# EAGLE design Cyllene (EAGLE 9.6.2)
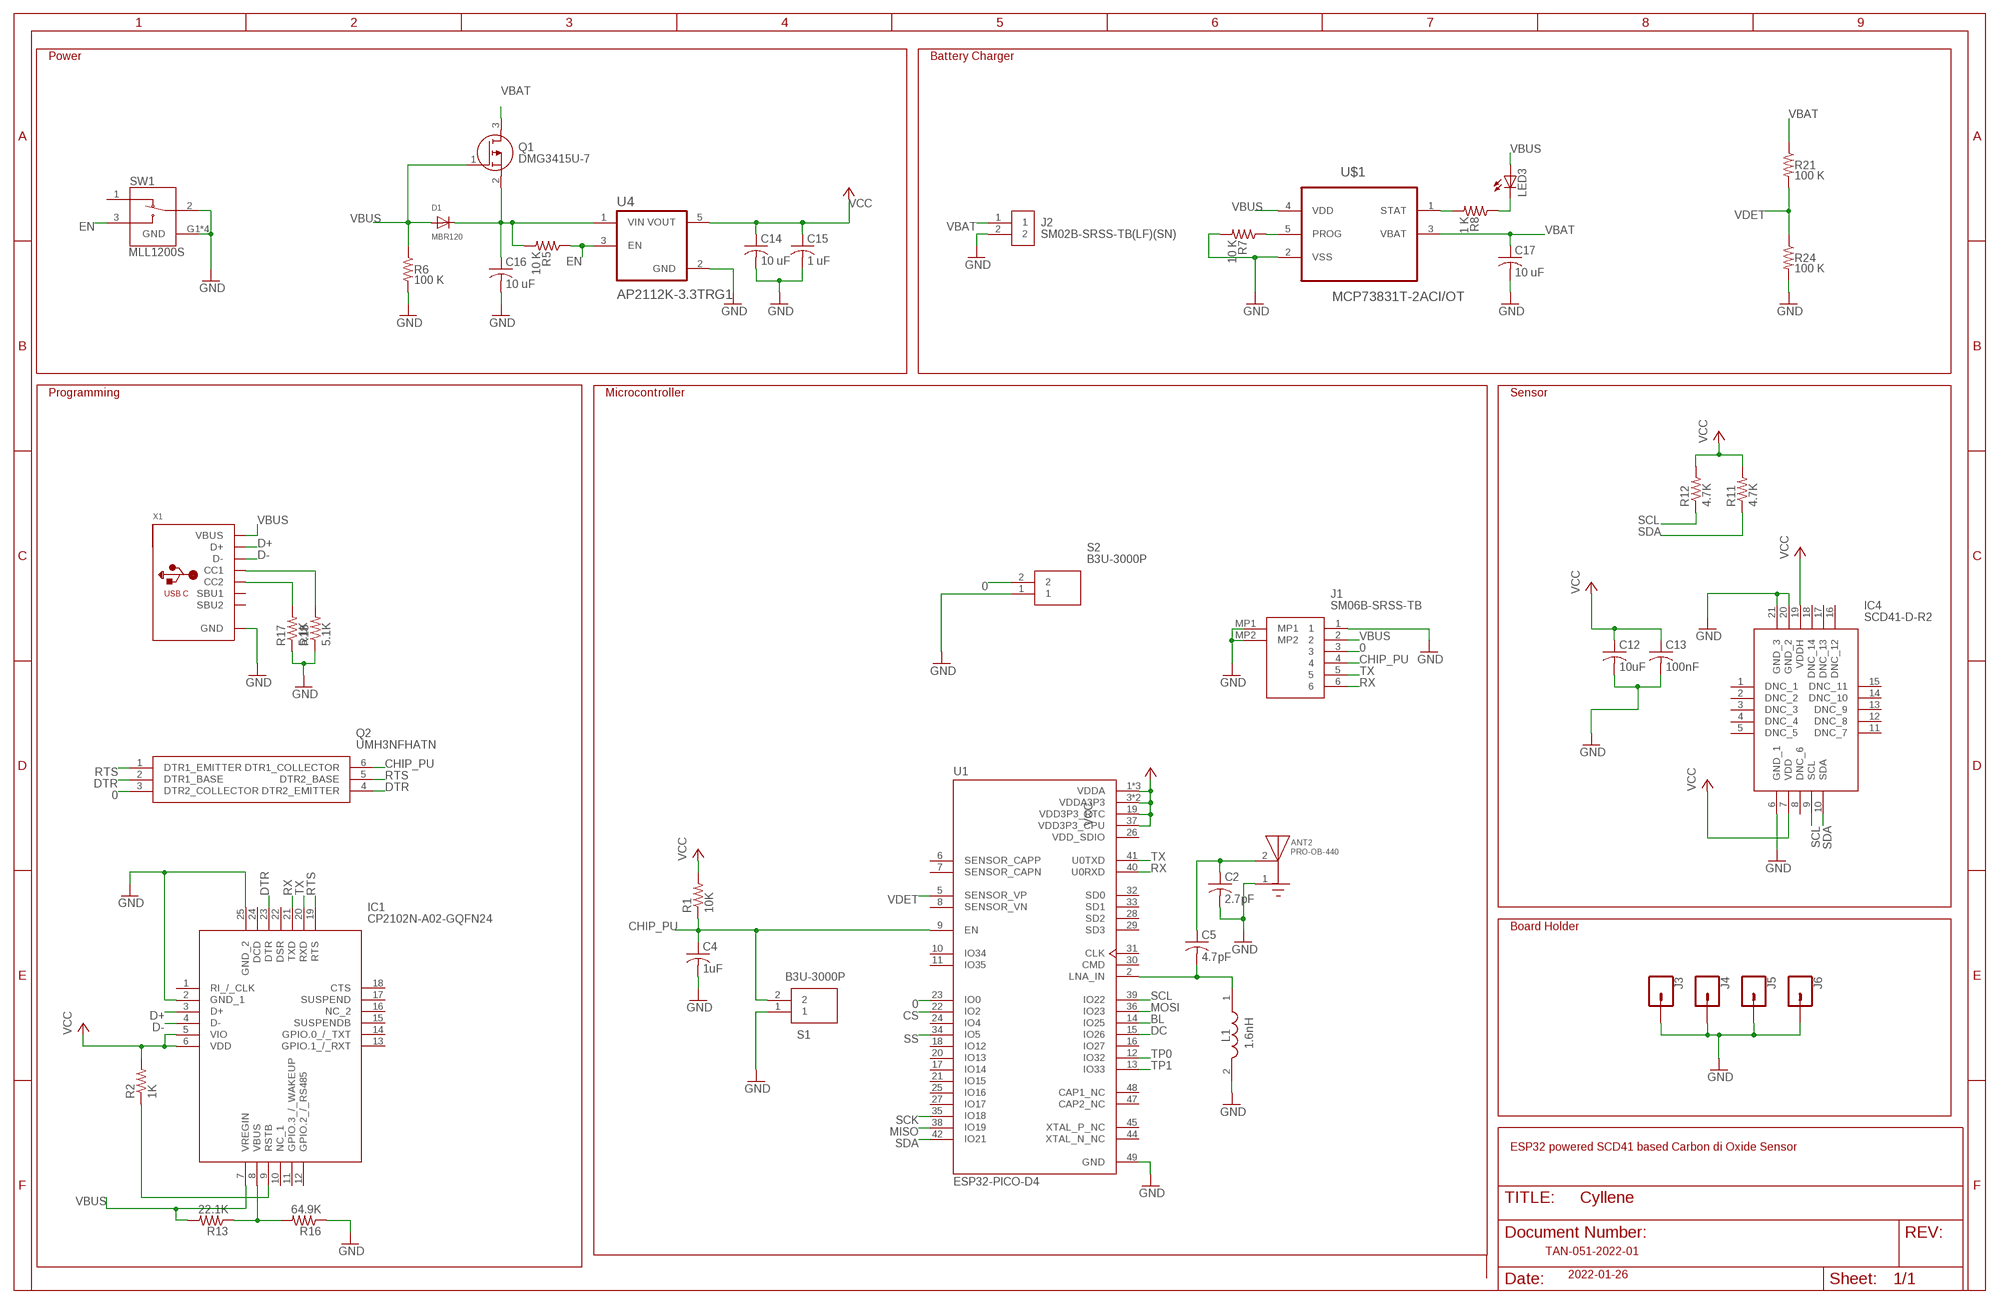
[diagram p0: schematic, sheet 1]

## Parts
ANT2  PRO-OB-440  [ANT_PRO-OB-440]
C2  2.7pF  C-USC0402  [C0402]
C4  1uF  C-USC0402  [C0402]
C5  4.7pF  C-USC0402  [C0402]
C12  10uF  C-USC0402  [C0402]
C13  100nF  C-USC0402  [C0402]
C14  10 uF  C-USC0402  [C0402]
C15  1 uF  C-USC0402  [C0402]
C16  10 uF  C-USC0402  [C0402]
C17  10 uF  C-USC0402  [C0402]
D1  MBR120  DIODESOD-123  [SOD-123]
IC1  CP2102N-A02-GQFN24  [QFN50P400X400X80-25N]
IC4  SCD41-D-R2  [SCD41DR2]
J1  SM06B-SRSS-TB  [SM06BSRSSTB]
J2  SM02B-SRSS-TB(LF)(SN)  [SM02B-SRSS-TB(LF)(SN)]
J3  CONN_01PTH_2MM  [1X01_2MM]
J4  CONN_01PTH_2MM  [1X01_2MM]
J5  CONN_01PTH_2MM  [1X01_2MM]
J6  CONN_01PTH_2MM  [1X01_2MM]
L1  1.6nH  LQG15WZ1N6C02D  [LQW15CNR20J00B]
LED3  LEDCHIPLED_0603  [CHIPLED_0603]
Q1  DMG3415U-7  [SOT96P240X100-3N]
Q2  UMH3NFHATN  [SOT65P210X100-6N]
R1  10K  R-US_R0402  [R0402]
R2  1K  R-US_R0402  [R0402]
R5  10 K  R-US_R0402  [R0402]
R6  100 K  R-US_R0402  [R0402]
R7  10 K  R-US_R0402  [R0402]
R8  1 K  R-US_R0402  [R0402]
R11  4.7K  R-US_R0402  [R0402]
R12  4.7K  R-US_R0402  [R0402]
R13  22.1K  R-US_R0402  [R0402]
R16  64.9K  R-US_R0402  [R0402]
R17  5.1K  R-US_R0402  [R0402]
R18  5.1K  R-US_R0402  [R0402]
R21  100 K  R-US_R0402  [R0402]
R24  100 K  R-US_R0402  [R0402]
S1  B3U-3000P  [B3U-1000P]
S2  B3U-3000P  [B3U-1000P]
SW1  MLL1200S  [SW_MLL1200S]
U1  ESP32-PICO-D4  [PQFN50P700X700X104-49N]
U4  AP2112K-3.3TRG1  [SOT95P285X140-5N]
U$1  MCP73831T-2ACI/OT  [SOT95P280X145-5N]
X1  MICROBUILDER_USB_C  [MICROBUILDER_USB_C_CUSB31-CFM2AX-01-X]

## Nets
0: J1.3 Q2.3(DTR2_COLLECTOR) S2.2 U1.23(IO0)
BL: U1.14(IO25)
CHIP_PU: C4.1 J1.4 Q2.6(DTR1_COLLECTOR) R1.1 S1.2 U1.9(EN)
CS: U1.22(IO2)
D+: IC1.3(D+) X1.A6(D+) X1.B6(D+)
D-: IC1.4(D-) X1.A7(D-) X1.B7(D-)
DC: U1.15(IO26)
DTR: IC1.23(DTR) Q2.2(DTR1_BASE) Q2.4(DTR2_EMITTER)
EN: R5.1 SW1.3 U4.3(EN)
GND: ANT2.1(GND) C2.2 C4.2 C12.2 C13.2 C14.2 C15.2 C16.2 C17.2 IC1.2(GND_1) IC1.25(GND_2) IC4.6(GND_1) IC4.20(GND_2) IC4.21(GND_3) J1.1 J1.MP1 J1.MP2 J2.2 J3.1 J4.1 J5.1 J6.1 L1.2 R6.2 R7.2 R16.1 R17.1 R18.1 R24.2 S1.1 S2.1 SW1.2 SW1.G1(GND) SW1.G2(GND) SW1.G3(GND) SW1.G4(GND) U1.49(GND) U4.2(GND) U$1.2(VSS) X1.A1B12(GND) X1.B1A12(GND)
MISO: U1.38(IO19)
MOSI: U1.36(IO23)
N$1: C5.2 L1.1 U1.2(LNA_IN)
N$4: ANT2.2(FEED) C2.1 C5.1
N$10: C16.1 D1.C Q1.2(S) R5.2 U4.1(VIN)
N$18: IC1.9(RSTB) R2.1
N$19: IC1.8(VBUS) R13.1 R16.2
N$20: R18.2 X1.A5(CC1)
N$21: R17.2 X1.B5(CC2)
N$23: R8.2 U$1.1(STAT)
N$26: R7.1 U$1.5(PROG)
N$30: LED3.C R8.1
RTS: IC1.19(RTS) Q2.1(DTR1_EMITTER) Q2.5(DTR2_BASE)
RX: IC1.21(TXD) J1.6 U1.40(U0RXD)
SCK: U1.35(IO18)
SCL: IC4.9(SCL) R12.1 U1.39(IO22)
SDA: IC4.10(SDA) R11.1 U1.42(IO21)
SS: U1.34(IO5)
TP0: U1.12(IO32)
TP1: U1.13(IO33)
TX: IC1.20(RXD) J1.5 U1.41(U0TXD)
VBAT: C17.1 J2.1 Q1.3(D) R21.1 U$1.3(VBAT)
VBUS: D1.A IC1.7(VREGIN) J1.2 LED3.A Q1.1(G) R6.1 R13.2 U$1.4(VDD) X1.A4B9(VBUS) X1.B4A9(VBUS)
VCC: C12.1 C13.1 C14.1 C15.1 IC1.5(VIO) IC1.6(VDD) IC4.7(VDD) IC4.19(VDDH) R1.2 R2.2 R11.2 R12.2 U1.1(VDDA) U1.3(VDDA3P3) U1.4(VDDA3P3) U1.19(VDD3P3_RTC) U1.37(VDD3P3_CPU) U1.43(VDDA) U1.46(VDDA) U4.5(VOUT)
VDET: R21.2 R24.1 U1.5(SENSOR_VP)
Unconnected: IC1.1(RI_/_CLK) IC1.10(NC_1) IC1.11(GPIO.3_/_WAKEUP) IC1.12(GPIO.2_/_RS485) IC1.13(GPIO.1_/_RXT) IC1.14(GPIO.0_/_TXT) IC1.15(SUSPENDB) IC1.16(NC_2) IC1.17(SUSPEND) IC1.18(CTS) IC1.22(DSR) IC1.24(DCD) IC4.1(DNC_1) IC4.2(DNC_2) IC4.3(DNC_3) IC4.4(DNC_4) IC4.5(DNC_5) IC4.8(DNC_6) IC4.11(DNC_7) IC4.12(DNC_8) IC4.13(DNC_9) IC4.14(DNC_10) IC4.15(DNC_11) IC4.16(DNC_12) IC4.17(DNC_13) IC4.18(DNC_14) SW1.1 U1.6(SENSOR_CAPP) U1.7(SENSOR_CAPN) U1.8(SENSOR_VN) U1.10(IO34) U1.11(IO35) U1.16(IO27) U1.17(IO14) U1.18(IO12) U1.20(IO13) U1.21(IO15) U1.24(IO4) U1.25(IO16) U1.27(IO17) U1.28(SD2) U1.29(SD3) U1.30(CMD) U1.31(CLK) U1.32(SD0) U1.33(SD1) U1.44(XTAL_N_NC) U1.45(XTAL_P_NC) U1.47(CAP2_NC) U1.48(CAP1_NC) X1.A8(SBU1) X1.B8(SBU2)

## Notes on the sheet
- Power | Battery Charger
- Programming | Microcontroller | Sensor
- Board Holder
- ESP32 powered SCD41 based Carbon di Oxide Sensor
- TAN-051-2022-01
- 2022-01-26

## Power pins joined to a net without a drawn wire
VDD_SDIO: U1.26(VDD_SDIO)

## Library data of the parts
ANT2 = PRO-OB-440:PRO-OB-440: Ic Antenna Onboard 2400 Smd; AVAILABILITY: Unavailable; DESCRIPTION: Ic Antenna Onboard 2400 Smd; MF: Proant AB; MP: PRO-OB-440; PACKAGE: None; PRICE: None
C2 C4 C5 C12-C17 = adafruit:C-US: CAPACITOR, American symbol
D1 = adafruit:DIODE: Diode SMADIODE - SMA Surface Mount Package 20V 1A Schottky Diode Digikey: 641-1014-6-ND DO-1N4148 - Through Hole Small Current Diode SOD-123 20V 1 A (.5mV Vf) Schottky Diode - Digikey: MBRX120TPMSCT-ND SOD-323 10V 570mA (.38mV Vf, 3ns) Schottky Diode - Digikey: ZLLS410CT-ND SOD-523 30V 30mA Schottky Diode (RB751S-40TE61) - Digikey: RB751S-40TE61CT-ND SOT23-R/W - SOT23 Package (R = Solder Paste/Reflow Ovens, W = Hand-Soldering) BAT54Film 40V 300mA - Digikey: 497-7162-1-ND
IC1 = CP2102N-A02-GQFN24:CP2102N-A02-GQFN24: USB Interface IC USB to UART bridge - QFN24 Source: Datasheet <https://componentsearchengine.com/Datasheets/1/CP2102N-A02-GQFN24.pdf>; DESCRIPTION: USB Interface IC USB to UART bridge - QFN24; HEIGHT: 0.8mm; MANUFACTURER_NAME: Silicon Labs; MANUFACTURER_PART_NUMBER: CP2102N-A02-GQFN24; MOUSER_PART_NUMBER: 634-CP2102NA02GQFN24; MOUSER_PRICE-STOCK: https://www.mouser.co.uk/ProductDetail/Silicon-Labs/CP2102N-A02-GQFN24?qs=u16ybLDytRYKabtL%2FE7DZA%3D%3D
IC4 = SCD41-D-R2:SCD41-D-R2: Air Quality Sensor CO2 Sensor 2.5V/3.3V/5V 20-Pin SMD EP Source: Datasheet; DESCRIPTION: Air Quality Sensor CO2 Sensor 2.5V/3.3V/5V 20-Pin SMD EP; HEIGHT: 6.8mm; MANUFACTURER_NAME: Sensirion; MANUFACTURER_PART_NUMBER: SCD41-D-R2; MOUSER_PART_NUMBER: 403-SCD41-D-R2; MOUSER_PRICE-STOCK: https://www.mouser.co.uk/ProductDetail/Sensirion/SCD41-D-R2?qs=HBWAp0VN4Ri4o7ei4T3s0g%3D%3D
J1 = SM06B-SRSS-TB:SM06B-SRSS-TB: CONN HEADER SH 6POS SIDE 1MM TIN Source: Datasheet <https://media.digikey.com/pdf/Data Sheets/JST PDFs/SR Connector.pdf>; DESCRIPTION: CONN HEADER SH 6POS SIDE 1MM TIN; HEIGHT: 2.95mm; MANUFACTURER_NAME: JST (JAPAN SOLDERLESS TERMINALS); MANUFACTURER_PART_NUMBER: SM06B-SRSS-TB
J2 = SM02B-SRSS-TB_LF__SN_:SM02B-SRSS-TB(LF)(SN): JST (JAPAN SOLDERLESS TERMINALS) - SM02B-SRSS-TB (LF)(SN) - HEADER, R/A, 2WAY Source: Datasheet <http://www.jst-mfg.com/product/pdf/eng/eSH.pdf> Check prices <https://pricing.snapeda.com/parts/SM02B-SRSS-TB%28LF%29%28SN%29/JST%20Sales/view-part?ref=eda>; AVAILABILITY: In Stock; DESCRIPTION: Connector Header Surface Mount, Right Angle 2 position 0.039 (1.00mm); MF: JST Sales; MP: SM02B-SRSS-TB(LF)(SN); PACKAGE: None; PRICE: None
J3-J6 = SparkFun-Connectors:CONN_01: Single connection point. Often used as Generic Header-pin footprint for 0.1 inch spaced/style header connections On any of the 0.1 inch spaced packages, you can populate with these: Break Away Headers - Straight <https://www.sparkfun.com/products/116> (PRT-00116) Break Away Male Headers - Right Angle <https://www.sparkfun.com/products/553> (PRT-00553) Female Headers <https://www.sparkfun.com/products/115> (PRT-00115) Break Away Headers - Machine Pin <https://www.sparkfun.com/products/117> (PRT-00117) Break Away Female Headers - Swiss Machine Pin <https://www.sparkfun.com/products/743> (PRT-00743) This device is also useful as a general connection point to wire up your design to another part of your project. Our various solder wires solder well into these plated through hole pads. Hook-Up Wire - Assortment (Stranded, 22 AWG) <https://www.sparkfun.com/products/11375> (PRT-11375) Hook-Up Wire - Assortment (Solid Core, 22 AWG) <https://www.sparkfun.com/products/11367> (PRT-11367) View the entire wire category on our website here <https://www.sparkfun.com/categories/141> Special notes: SMTSO-256-ET is a "flush mount" nut for a 4-40 screw. We mostly use this on specialty testbeds; it is a nice way to connect hardware to your PCB at an adjustable hieght. Also note, the SNAP packages are for using a snappable style connector. We sell a baggie of snaps and they are also used on two LilyPad designs: Snap Assortment - 30 pack (male and female) <https://www.sparkfun.com/products/11347> (DEV-11347) LilyPad Arduino SimpleSnap <https://www.sparkfun.com/products/10941> (DEV-10941) LilyPad SimpleSnap Protoboard <https://www.sparkfun.com/products/10940> (DEV-10940)
L1 = 1.6nH-0402-LQG15WZ1N6C02D:LQG15WZ1N6C02D: LQG15WZ_02 Series Inductor 1.6nH +/-0.2nH 0402 (1005) Source: Datasheet <https://psearch.en.murata.com/inductor/product/LQG15WZ1N6C02#.html>; DESCRIPTION: LQG15WZ_02 Series Inductor 1.6nH +/-0.2nH 0402 (1005); HEIGHT: 0.6mm; MANUFACTURER_NAME: Murata Electronics; MANUFACTURER_PART_NUMBER: LQG15WZ1N6C02D; MOUSER_PART_NUMBER: 81-LQG15WZ1N6C02D; MOUSER_PRICE-STOCK: https://www.mouser.co.uk/ProductDetail/Murata-Electronics/LQG15WZ1N6C02D?qs=qkDYIeTQ%252BEnub25z76iXsA%3D%3D
LED3 = adafruit:LED: LED OSRAM: - CHIPLED LG R971, LG N971, LY N971, LG Q971, LY Q971, LO R971, LY R971 LH N974, LH R974 LS Q976, LO Q976, LY Q976 LO Q996 - Hyper CHIPLED LW Q18S LB Q993, LB Q99A, LB R99A - SideLED LS A670, LO A670, LY A670, LG A670, LP A670 LB A673, LV A673, LT A673, LW A673 LH A674 LY A675 LS A676, LA A676, LO A676, LY A676, LW A676 LS A679, LY A679, LG A679 - Hyper Micro SIDELED® LS Y876, LA Y876, LO Y876, LY Y876 LT Y87S - SmartLED LW L88C, LW L88S LB L89C, LB L89S, LG L890 LS L89K, LO L89K, LY L89K LS L896, LA L896, LO L896, LY L896 - TOPLED LS T670, LO T670, LY T670, LG T670, LP T670 LSG T670, LSP T670, LSY T670, LOP T670, LYG T670 LG T671, LOG T671, LSG T671 LB T673, LV T673, LT T673, LW T673 LH T674 LS T676, LA T676, LO T676, LY T676, LB T676, LH T676, LSB T676, LW T676 LB T67C, LV T67C, LT T67C, LS T67K, LO T67K, LY T67K, LW E67C LS E67B, LA E67B, LO E67B, LY E67B, LB E67C, LV E67C, LT E67C LW T67C LS T679, LY T679, LG T679 LS T770, LO T770, LY T770, LG T770, LP T770 LB T773, LV T773, LT T773, LW T773 LH T774 LS E675, LA E675, LY E675, LS T675 LS T776, LA T776, LO T776, LY T776, LB T776 LHGB T686 LT T68C, LB T68C - Hyper Mini TOPLED® LB M676 - Mini TOPLED Santana® LG M470 LS M47K, LO M47K, LY M47K Source: http://www.osram.convergy.de/
Q1 = DMG3415U-7:DMG3415U-7: P-CHANNEL ENHANCEMENT MODE MOSFET Source: Datasheet <https://datasheet.lcsc.com/szlcsc/Diodes-Incorporated-DMG3415U-7_C96616.pdf>; DESCRIPTION: P-CHANNEL ENHANCEMENT MODE MOSFET; HEIGHT: 1mm; LCSC_PART_NUMBER: C96616; LCSC_PRICE-STOCK: https://lcsc.com/product-detail/MOSFET_Diodes-Incorporated_DMG3415U-7_Diodes-Incorporated-DMG3415U-7_C96616.html; MANUFACTURER_NAME: Diodes Inc.; MANUFACTURER_PART_NUMBER: DMG3415U-7
Q2 = UMH3NFHATN:UMH3NFHATN: ROHM - UMH3NFHATN - TRANS, NPN, AUTO, 4.7K/4.7K, SOT-353 Source: Datasheet <https://componentsearchengine.com/Datasheets/1/UMH3NFHATN.pdf>; DESCRIPTION: ROHM - UMH3NFHATN - TRANS, NPN, AUTO, 4.7K/4.7K, SOT-353; HEIGHT: 1mm; MANUFACTURER_NAME: ROHM Semiconductor; MANUFACTURER_PART_NUMBER: UMH3NFHATN; MOUSER_PART_NUMBER: 755-UMH3NFHATN; MOUSER_PRICE-STOCK: https://www.mouser.com/Search/Refine.aspx?Keyword=755-UMH3NFHATN
R1 R2 R5-R8 R11-R13 R16-R18 R21 R24 = adafruit:R-US_: RESISTOR, American symbol
S1 S2 = B3U-3000P:B3U-3000P: OMRON ELECTRONIC COMPONENTS - B3U-3000P - TACTILE SWITCH, SIDE ACTUATED, SMD Source: Datasheet <http://omronfs.omron.com/en_US/ecb/products/pdf/en-b3u.pdf>; DESCRIPTION: OMRON ELECTRONIC COMPONENTS - B3U-3000P - TACTILE SWITCH, SIDE ACTUATED, SMD; HEIGHT: mm; MANUFACTURER_NAME: Omron Electronics; MANUFACTURER_PART_NUMBER: B3U-3000P; MOUSER_PART_NUMBER: 653-B3U-3000P; MOUSER_PRICE-STOCK: https://www.mouser.co.uk/ProductDetail/Omron-Electronics/B3U-3000P?qs=AO7BQMcsEu4un9I7hS23xg%3D%3D
SW1 = MLL1200S:MLL1200S: Switch Slide SPDT Side Slide 0.3A 4VDC Gull Wing SMD Box Check prices <https://pricing.snapeda.com/parts/MLL1200S/TE%20Connectivity/view-part?ref=eda>; AVAILABILITY: In Stock; COMMENT: 1437575-1; DESCRIPTION: Slide Switch SPDT Surface Mount, Right Angle; MF: TE Connectivity; MP: MLL1200S; PACKAGE: None; PRICE: None; PURCHASE-URL: https://pricing.snapeda.com/search/part/MLL1200S/?ref=eda
U1 = ESP32-PICO-D4:ESP32-PICO-D4: Bluetooth, WiFi 802.11b/g/n, Bluetooth v4.2 +EDR, Class 1, 2 and 3 Transceiver Module 2.4GHz ~ 2.5GHz Surface Mount Check prices <https://pricing.snapeda.com/parts/ESP32-PICO-D4/Espressif%20Systems/view-part?ref=eda>; AVAILABILITY: In Stock; DESCRIPTION: Bluetooth, WiFi 802.11b/g/n, Bluetooth v4.2 +EDR, Class 1, 2 and 3 Transceiver Module 2.4GHz ~ 2.5GHz Surface Mount; MF: Espressif Systems; MP: ESP32-PICO-D4; PACKAGE: SMD-48 Espressif Systems; PRICE: None
U4 = AP2112K-3.3TRG1:AP2112K-3.3TRG1: AP2112 Series 0.6 A 3.3 V Fixed Output SMT LDO Linear Regulator - SOT23-5; AVAILABILITY: Unavailable; DESCRIPTION: AP2112 Series 0.6 A 3.3 V Fixed Output SMT LDO Linear Regulator - SOT23-5; MF: Diodes Inc.; MP: AP2112K-3.3TRG1; PACKAGE: SOT-753 Diodes Inc.; PRICE: None
U$1 = MCP73831T-2ACI_OT:MCP73831T-2ACI/OT: Charge Management Controller; AVAILABILITY: Unavailable; DESCRIPTION: MCP73831 Series Single-Cell Li-Ion/Li-Polymer Battery Charge Controller SOT-23-5; MF: Microchip; MP: MCP73831T-2ACI/OT; PACKAGE: SOT-23 Microchip; PRICE: None
X1 = Adafruit Feather STM32F405 Express:MICROBUILDER_USB_C: USB Type-C USB 2.0 Connector

## Board
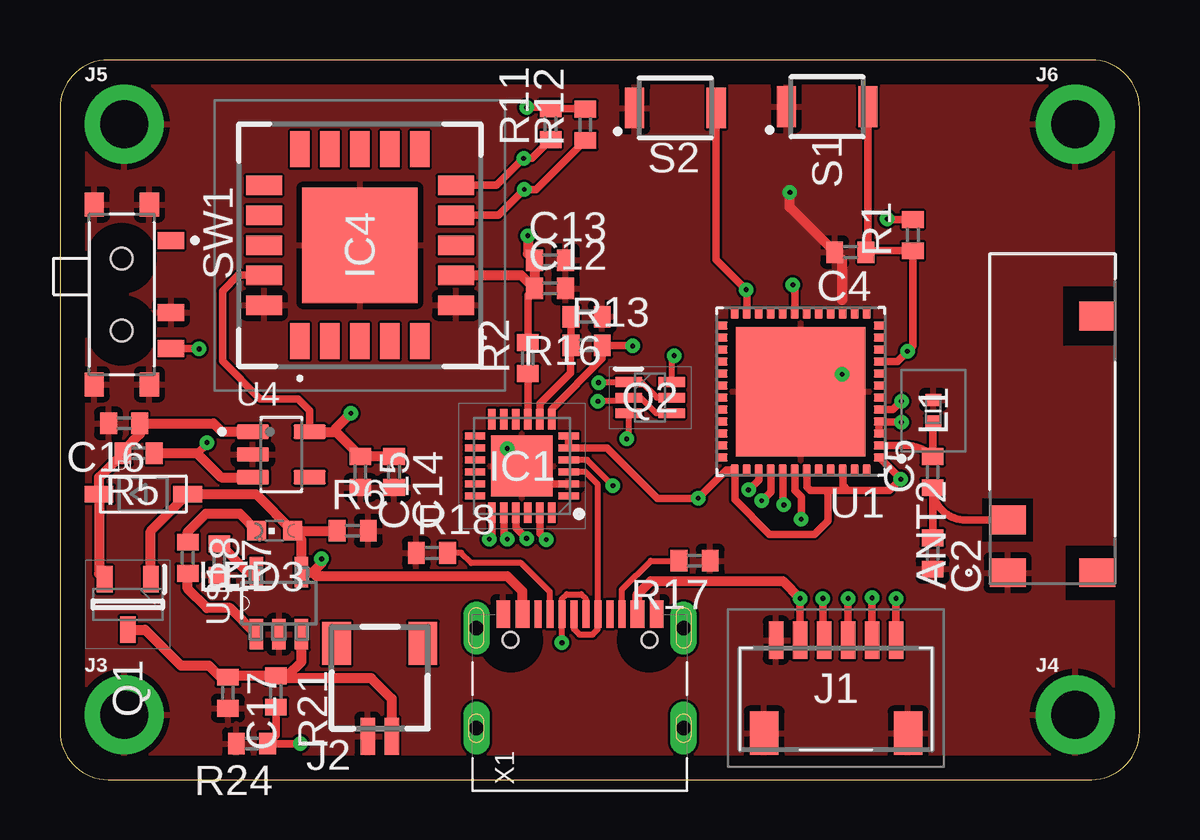
[diagram p1: board, top side]
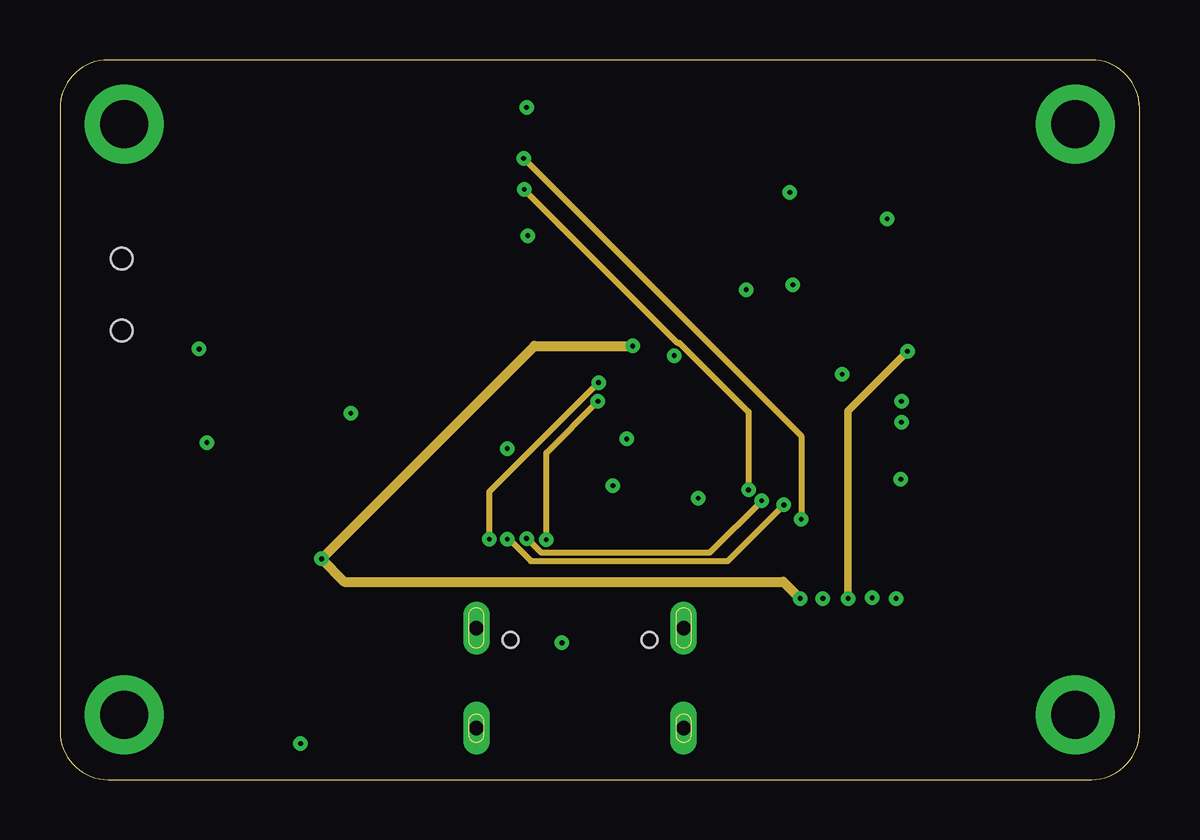
[diagram p2: board, inner layer Route2]
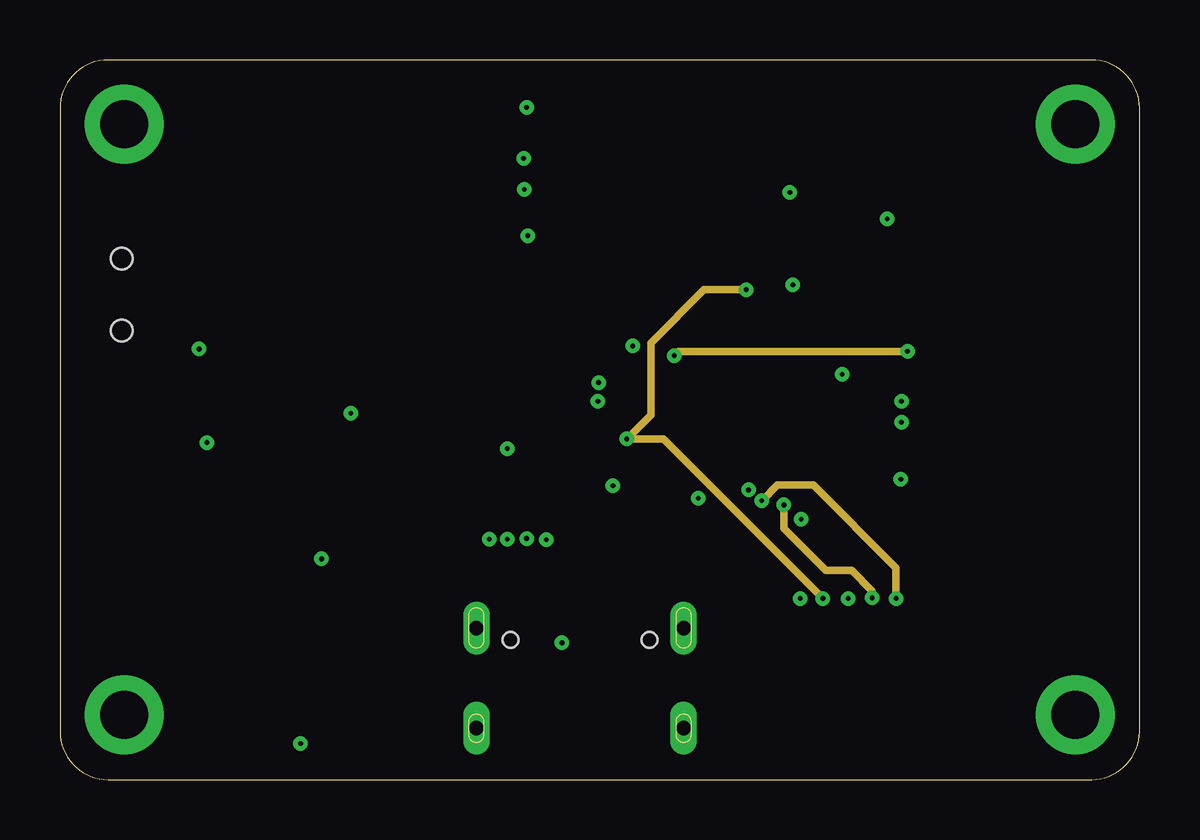
[diagram p3: board, inner layer Route15]
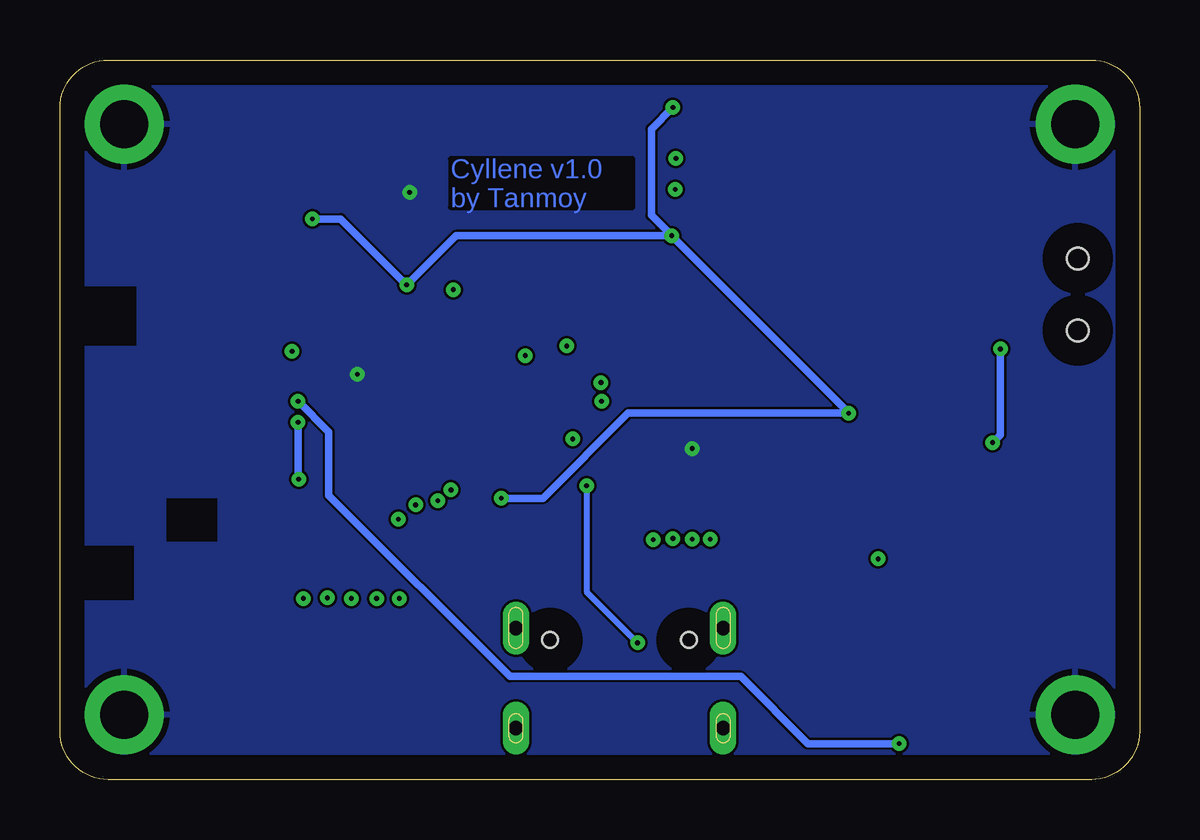
[diagram p4: board, bottom side, seen from below]

Size 45 x 30 mm. Coordinates in mm from the lower left corner, seen from the top.
Outline: 2,0 43,0 arc90 45,2 45,28 arc90 43,30 2,30 arc90 0,28 0,2 arc90 2,0
Copper layers (1+2*15+16): Top 0.035mm / dielectric 1.5mm / Route2 0.035mm / dielectric 0.15mm / Route15 0.035mm / dielectric 0.2mm / Bottom 0.035mm
Design rules "default *": minimum track width 4mil, minimum drill 0.2mm, track to track 4mil, track to pad 4mil, pad to pad 4mil, via to via 4mil, smd to smd 4mil, copper to edge 40mil, drill to drill 6mil, minimum pad ring 10mil, minimum via ring 8mil, stop-mask expansion 4mil, vias tented up to drill 0mil, thermal gap 10mil

### Footprints (pad centres in the part's own frame; a part is rotated, then mirrored left to right if it is on the bottom)
ANT_PRO-OB-440 = smd 1.2 x 1.5: 1 0,0; 2 2.2,0; 3 0,-3.73; 4 10.7,-3.73
C0402 = smd 0.7 x 0.9: 1 -0.65,0; 2 0.65,0
SOD-123 = smd 1.2 x 0.7: A 1.85,0; C -1.85,0
QFN50P400X400X80-25N = smd 0.85 x 0.3: 1 -1.95,1.25; 2 -1.95,0.75; 3 -1.95,0.25; 4 -1.95,-0.25; 5 -1.95,-0.75; 6 -1.95,-1.25; 13 1.95,-1.25; 14 1.95,-0.75; 15 1.95,-0.25; 16 1.95,0.25; 17 1.95,0.75; 18 1.95,1.25 | smd 0.3 x 0.85: 7 -1.25,-1.95; 8 -0.75,-1.95; 9 -0.25,-1.95; 10 0.25,-1.95; 11 0.75,-1.95; 12 1.25,-1.95; 19 1.25,1.95; 20 0.75,1.95; 21 0.25,1.95; 22 -0.25,1.95; 23 -0.75,1.95; 24 -1.25,1.95 | smd 2.55 x 2.55: 25 0,0
SCD41DR2 = smd 1.5 x 0.8: 1 -4,2.5; 2 -4,1.25; 3 -4,0; 4 -4,-1.25; 5 -4,-2.5; 11 4,-2.5; 12 4,-1.25; 13 4,0; 14 4,1.25; 15 4,2.5 | smd 0.8 x 1.5: 6 -2.5,-4; 7 -1.25,-4; 8 0,-4; 9 1.25,-4; 10 2.5,-4; 16 2.5,4; 17 1.25,4; 18 0,4; 19 -1.25,4; 20 -2.5,4 | smd 4.8 x 4.8: 21 0,0
SM06BSRSSTB = smd 0.6 x 1.55: 1 -2.5,2.287; 2 -1.5,2.287; 3 -0.5,2.287; 4 0.5,2.287; 5 1.5,2.287; 6 2.5,2.287 | smd 1.2 x 1.8: MP1 -3,-1.588; MP2 3,-1.588
SM02B-SRSS-TB(LF)(SN) = smd 0.6 x 1.55: 1 -0.5,1.975; 2 0.5,1.975 | smd 1.2 x 1.8: 3 -1.8,-1.9; 4 1.8,-1.9
1X01_2MM = drill 2 pad 3.302: 1 0,0
LQW15CNR20J00B = smd 0.5 x 0.66: 1 -0.45,0; 2 0.45,0
CHIPLED_0603 = smd 0.8 x 0.8: A 0,-0.75; C 0,0.75
SOT96P240X100-3N = smd 1.1 x 0.65: 1 -1.05,0.96; 2 -1.05,-0.96; 3 1.05,0
SOT65P210X100-6N = smd 1.1 x 0.4: 1 -0.9,0.65; 2 -0.9,0; 3 -0.9,-0.65; 4 0.9,-0.65; 5 0.9,0; 6 0.9,0.65
R0402 = smd 0.7 x 0.9: 1 -0.65,0; 2 0.65,0
B3U-1000P = smd 0.8 x 1.7: 1 1.7,0; 2 -1.7,0
SW_MLL1200S = smd 0.7 x 1.1: 1 -2.25,2.05; 2 0.75,2.05; 3 2.25,2.05 | smd 1 x 0.8: G1 -3.75,1.15; G2 3.75,1.15; G3 -3.75,-1.15; G4 3.75,-1.15 | hole 0.9: -1.5,0; 1.5,0
PQFN50P700X700X104-49N = smd 0.45 x 0.35: 1 -3.265,2.75; 2 -3.265,2.25; 3 -3.265,1.75; 4 -3.265,1.25; 5 -3.265,0.75; 6 -3.265,0.25; 7 -3.265,-0.25; 8 -3.265,-0.75; 9 -3.265,-1.25; 10 -3.265,-1.75; 11 -3.265,-2.25; 12 -3.265,-2.75; 25 3.265,-2.75; 26 3.265,-2.25; 27 3.265,-1.75; 28 3.265,-1.25; 29 3.265,-0.75; 30 3.265,-0.25; 31 3.265,0.25; 32 3.265,0.75; 33 3.265,1.25; 34 3.265,1.75; 35 3.265,2.25; 36 3.265,2.75 | smd 0.35 x 0.45: 13 -2.75,-3.265; 14 -2.25,-3.265; 15 -1.75,-3.265; 16 -1.25,-3.265; 17 -0.75,-3.265; 18 -0.25,-3.265; 19 0.25,-3.265; 20 0.75,-3.265; 21 1.25,-3.265; 22 1.75,-3.265; 23 2.25,-3.265; 24 2.75,-3.265; 37 2.75,3.265; 38 2.25,3.265; 39 1.75,3.265; 40 1.25,3.265; 41 0.75,3.265; 42 0.25,3.265; 43 -0.25,3.265; 44 -0.75,3.265; 45 -1.25,3.265; 46 -1.75,3.265; 47 -2.25,3.265; 48 -2.75,3.265 | smd 5.4 x 5.4: 49 0,0
SOT95P285X140-5N = smd 1.35 x 0.6: 1 -1.185,0.95; 2 -1.185,0; 3 -1.185,-0.95; 4 1.185,-0.95; 5 1.185,0.95
SOT95P280X145-5N = smd 1.27 x 0.559: 1 -1.295,0.94; 2 -1.295,0; 3 -1.295,-0.94; 4 1.295,-0.94; 5 1.295,0.94
MICROBUILDER_USB_C_CUSB31-CFM2AX-01-X = smd 0.575 x 1.15: A1B12 -3.2,3.545; A4B9 -2.4,3.545; B1A12 3.2,3.545; B4A9 2.4,3.545 | smd 0.275 x 1.15: A5 -1.25,3.545; A6 -0.25,3.545; A7 0.25,3.545; A8 1.25,3.545; B5 1.75,3.545; B6 0.75,3.545; B7 -0.75,3.545; B8 -1.75,3.545 | drill 0.6 pad 1 long: M1 -4.32,2.97; M2 4.32,2.97; M3 -4.32,-1.21; M4 4.32,-1.21 | hole 0.65: 2.89,2.47; -2.89,2.47

### Placement (x,y rotation side)
ANT2  39.5,8.62 90 top
C2  36.38,9.43 270 top
C4  32.95,21.98 180 top
C5  36.38,12.81 90 top
C12  20.43,20.48 0 top
C13  20.43,21.65 0 top
C14  13.93,12.82 270 top
C15  12.53,12.82 270 top
C16  2.67,14.85 180 top
C17  7,3.62 270 top
D1  3.48,11.9 0 top
IC1  19.25,13.07 180 top
IC4  12.5,22.27 90 top
J1  32.35,3.52 0 top
J2  13.32,3.77 180 top
J3  2.67,2.7 0 top
J4  42.33,2.7 0 top
J5  2.67,27.32 0 top
J6  42.33,27.32 0 top
L1  36.4,15.38 90 top
LED3  8.95,10.38 90 top
Q1  2.83,7.3 270 top
Q2  24.6,15.93 0 top
R1  35.55,22.7 90 top
R2  19.5,17.57 90 top
R5  3.27,13.6 180 top
R6  12.2,10.38 0 top
R7  6.65,9.18 270 top
R8  5.33,9.25 270 top
R11  20.45,27.32 90 top
R12  21.9,27.3 90 top
R13  21.95,18.1 0 top
R16  21.95,19.3 180 top
R17  26.45,9.12 180 top
R18  15.5,9.45 0 top
R21  9,3.67 270 top
R24  8,1.5 180 top
S1  31.98,28.05 180 top
S2  25.65,28 180 top
SW1  2.58,20.23 270 top
U1  30.88,16.18 180 top
U4  9.22,13.55 0 top
U$1  9.12,7.35 90 top
X1  21.68,3.35 0 top

### Tracks (layer width: path | path; a pad name or v marks a point on that pad's centre or on a via)
0  (via drill 0.2)
  Top 0.254: Q2.3 23.7,14.28 v23.62,14.2
  Top 0.305: J1.3 31.8,5.86 v31.8,7.55 | U1.23 28.62,20.4 v28.6,20.43 27.35,21.68 S2.2
  Route15 0.305: v31.8,7.55 25.15,14.2 v23.62,14.2 24.62,15.2 24.62,18.2 26.85,20.43 v28.6,20.43
CHIP_PU  (via drill 0.2)
  Top 0.254: Q2.6 25.5,17.57 v25.6,17.68
  Top 0.305: U1.9 34.9,17.43 v35.33,17.85 35.55,18.07 R1.1 33.7,22.05 33.67,22.07 | J1.4 v32.85,7.55 | S1.2 33.67,22.07 | 33.67,22.07 C4.1
  Route2 0.305: v35.33,17.85 32.85,15.38 v32.85,7.55
  Route15 0.305: v25.6,17.68 25.77,17.85 v35.33,17.85
D+
  Top 0.254: X1.A6 21.43,6.28 21.65,6.05 22.2,6.05 22.43,6.28 X1.B6 22.43,12.3 21.9,12.82 IC1.3
D-  (via drill 0.2)
  Top 0.254: X1.A7 21.93,7.53 21.73,7.72 21.12,7.72 20.93,7.53 X1.B7 v20.93,5.7 | v23.05,12.25 21.98,13.32 IC1.4
  Bottom 0.254: v23.05,12.25 23.05,7.83 22.76,7.54 v20.93,5.7
DTR  (via drill 0.2)
  Top 0.254: v22.43,15.78 23.55,15.78 Q2.2 24.2,15.93 24.85,15.28 Q2.4
  Top 0.305: IC1.23 20,10.29 20.01,10.28 20.01,10.27 v20.27,10
  Route2 0.254: v20.27,10 20.27,13.62 v22.43,15.78
EN  (via drill 0.2)
  Top 0.305: SW1.3 5.78,17.98 v5.8,17.95 | v6.12,14.05 6.12,14 5.72,13.6
  Top 0.406: R5.1 5.72,13.6 6.72,12.6 U4.3
  Bottom 0.305: v5.8,17.95 5.8,14.38 v6.12,14.05
GND  (via drill 0.2)
  Top 0.305: IC1.2 20,12.32 IC1.25
  Top 0.406: U1.49 31.6,16.9 v32.6,16.9 | 32.6,19.97 32.6,21.68 C4.2 30.43,23.86 v30.43,24.48
  other vias: 18.65,13.8
  pour Top: 2.25,29.75 42.75,29.75 arc-90 44.75,27.75 44.75,2.25 arc-90 42.75,0.25 2.25,0.25 arc-90 0.25,2.25 0.25,27.75 arc-90
  pour Bottom: 2.25,29.75 42.75,29.75 arc-90 44.75,27.75 44.75,2.25 arc-90 42.75,0.25 2.25,0.25 arc-90 0.25,2.25 0.25,27.75 arc-90
N$1
  Top 0.305: U1.2 35.26,13.93 arc-45 C5.2 36.38,14.87 arc-45 L1.1
N$4
  Top 0.305: ANT2.2 37.75,10.82 arc-45 36.76,11.24 arc-45 C5.1 C2.1
N$10
  Top 0.406: Q1.2 1.62,8.59 D1.C 1.62,12.6 R5.2 2.62,13.7 3.33,14.4 C16.1 6.4,14.85 6.75,14.5 U4.1
N$18
  Top 0.305: IC1.9 R2.1
N$19
  Top 0.305: IC1.8 20,15.68 21.27,16.95 21.27,18.07 R13.1 R16.2
N$20
  Top 0.254: X1.A5 20.43,7.83 19.23,9.03 17.15,9.03 16.73,9.45 R18.2
N$21
  Top 0.254: X1.B5 23.43,7.92 24.62,9.12 R17.2
N$23
  Top 0.406: U$1.1 7.09,7.15 6.12,7.15 5.33,7.95 R8.2
N$26
  Top 0.406: R7.1 7.83,8.64 U$1.5
N$30
  Top 0.406: R8.1 5.33,10.32 6.08,11.07 7.5,11.07 LED3.C
RTS  (via drill 0.2)
  Top 0.254: v22.45,16.55 23.68,16.55 Q2.1 24.23,16.57 24.88,15.93 Q2.5
  Top 0.305: IC1.19 18,10.12 v17.9,10.03
  Route2 0.254: v22.45,16.55 22.21,16.31 22.2,16.31 17.9,12 v17.9,10.03
RX  (via drill 0.2)
  Top 0.305: U1.40 29.62,12 v29.25,11.62 | IC1.21 19,10.5 v19.45,10.05 | J1.6 v34.85,7.55
  Route2 0.254: v19.45,10.05 19.47,10.05 20.05,9.47 27.09,9.47 v29.25,11.62
  Route15 0.305: v29.25,11.62 29.9,12.28 31.4,12.28 34.85,8.82 v34.85,7.55
SCL  (via drill 0.2)
  Top 0.305: U1.39 29.12,12.5 v28.7,12.07 | IC4.9 18.27,23.52 v19.35,24.6 19.85,24.6 R12.1
  Route2 0.254: v19.35,24.6 25.74,18.21 25.82,18.21 28.7,15.33 v28.7,12.07
SDA  (via drill 0.2)
  Top 0.305: U1.42 30.62,12.05 30.9,11.78 v30.9,10.85 | IC4.10 18.2,24.77 v19.32,25.9 19.68,25.9 R11.1
  Route2 0.254: v19.32,25.9 30.9,14.32 v30.9,10.85
TX  (via drill 0.2)
  Top 0.305: U1.41 30.12,11.5 v30.18,11.45 | IC1.20 18.5,10.18 v18.65,10.03 | J1.5 v33.85,7.58
  Route2 0.254: v18.65,10.03 18.72,10.03 19.64,9.11 27.84,9.11 v30.18,11.45
  Route15 0.305: v30.18,11.45 30.18,10.47 31.93,8.72 33,8.72 33.85,7.88 v33.85,7.58
VBAT
  Top 0.406: U$1.3 10.01,6 | U$1.3 | Q1.3 3.55,6.25 5.04,4.76 6.2,4.76 6.68,4.28 C17.1 7.05,4.33 R21.1 | R21.1 9.47,4.33 10.06,4.92 U$1.3 | J2.1 13.82,3.38 12.97,4.22 9.1,4.22 R21.1
VBUS  (via drill 0.2)
  Top 0.305: IC1.7 20.5,15.45 22.6,17.55 R13.2 23.85,18.1 v23.88,18.07 | v30.85,7.55 J1.2
  Top 0.406: LED3.A 8.18,11.9 D1.A 3.79,10.36 Q1.1 | X1.A4B9 19.27,7.85 18.65,8.47 10.71,8.47 10.54,8.64 | 10.54,8.64 U$1.4 10.06,10.01 LED3.A | LED3.A R6.1 | 10.54,8.64 10.9,9.01 v10.9,9.2 | X1.B4A9 24.07,7.72 24.62,8.28 30.12,8.28 v30.85,7.55
  Route2 0.406: v23.88,18.07 19.77,18.07 v10.9,9.2 11.85,8.25 30.15,8.25 v30.85,7.55
VCC  (via drill 0.2)
  Top 0.254: 19.77,21.57 C13.1
  Top 0.305: U1.3 U1.4 34.16,14.9 v35.08,14.9 | U1.1 v35.05,12.53 34.58,12.05 32.85,12.05 | U1.46 32.62,12.28 32.85,12.05 | U1.43 31.12,12.2 31.27,12.05 32,12.05 | 32,12.05 32.85,12.05 | 32,12.05 32,10.78 31.45,10.22 29.57,10.22 28.12,11.68 U1.37 27.79,12.91 v26.6,11.72 24.9,11.72 22.8,13.82 IC1.5 IC1.6 | IC4.19 7.42,21.02 6.78,20.38 6.78,17.45 8.35,15.88 9.93,15.88 10.41,15.39 U4.5 | R12.2 21.88,27.98 R11.2 20.4,28.02 v19.45,28.02 | C12.1 19.5,20.2 R2.2 | R1.2 34.51,23.34 v34.48,23.38 | U1.19 30.62,20.55 v30.55,20.62
  Top 0.406: U4.5 11.5,14.5 | 11.5,14.5 C15.1 C14.1 | 11.5,14.5 11.5,14.65 v12.12,15.28 | IC4.7 19.23,21.02 C12.1 C13.1 19.5,21.93 v19.5,22.68
  Bottom 0.305: v26.6,11.72 24.88,11.72 21.32,15.28 v12.12,15.28 19.5,22.65 v19.5,22.68 | v35.08,14.9 35.08,12.55 v35.05,12.53 | v19.45,28.02 20.35,27.12 20.35,23.52 v19.5,22.68 | v19.5,22.68 28.5,22.68 v30.55,20.62 33.3,23.38 v34.48,23.38
VDET  (via drill 0.2)
  Top 0.305: U1.5 34.73,15.43 v35.08,15.78 | R21.2 9,1.85 R24.1 v10.03,1.5
  Bottom 0.305: v10.03,1.5 13.82,1.5 16.62,4.3 26.25,4.3 33.8,11.85 33.8,14.5 v35.08,15.78

### Text on the board
Bottom: Cyllene v1.0 / by Tanmoy